# EAGLE design opamp (EAGLE 9.1.3)
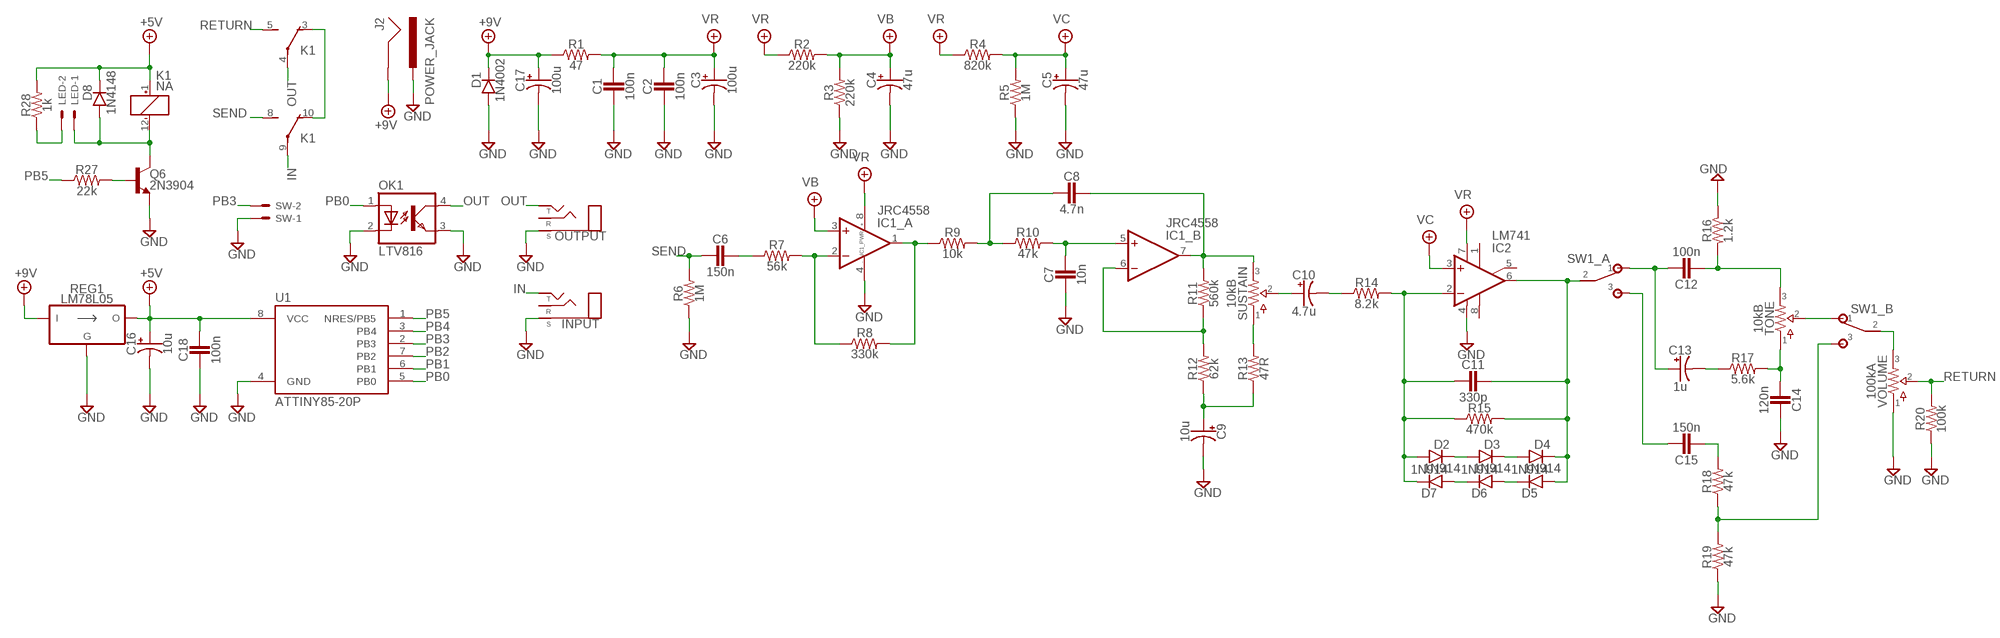
[diagram p0: schematic, sheet 1]

## Parts
C1  100n  CER/FILM2  [050X030_025_2]
C2  100n  CER/FILM2  [050X030_025_2]
C3  100u  0500  [050_020]
C4  47u  0500  [050_020]
C5  47u  0500  [050_020]
C6  150n  CER/FILMBOX.1  [BOX_SMALL]
C7  10n  CER/FILMBOX.1  [BOX_SMALL]
C8  4.7n  CER/FILMBOX.1  [BOX_SMALL]
C9  10u  0500  [050_020]
C10  4.7u  0500  [050_020]
C11  330p  CER/FILM2  [050X030_025_2]
C12  100n  CER/FILMBOX.1  [BOX_SMALL]
C13  1u  0400  [040_020]
C14  120n  CER/FILM2  [050X030_025_2]
C15  150n  CER/FILMBOX.1  [BOX_SMALL]
C16  10u  0500  [050_020]
C17  100u  0500  [050_020]
C18  100n  CER/FILM2  [050X030_025_2]
D1  1N4002  DO41.2  [DO41-2]
D2  1N914  DO35.2  [DO35-2]
D3  1N914  DO35.2  [DO35-2]
D4  1N914  DO35.2  [DO35-2]
D5  1N914  DO35.2  [DO35-2]
D6  1N914  DO35.2  [DO35-2]
D7  1N914  DO35.2  [DO35-2]
D8  1N4148  DO35.2  [DO35-2]
IC1  JRC4558  DUALTH  [DIL0]
IC2  LM741  SINGLETH  [DIL0]
INPUT  STEREONMJ  [NMJ6HCD2]
J2  POWER_JACK  [POWER_JACK_PTH]
K1  NA  [NA]
LED  JST-XH-02-PIN-ROUND-PAD  [JST-XH-02-PACKAGE-ROUND-PAD]
OK1  LTV816  [DIL04]
OUTPUT  STEREONMJ  [NMJ6HCD2]
Q6  2N3904  [TO92-]
R1  47  R_.3B  [R0207/3]
R2  220k  R_.3B  [R0207/3]
R3  220k  R_.3B  [R0207/3]
R4  820k  R_.3B  [R0207/3]
R5  1M  R_.3B  [R0207/3]
R6  1M  R_.3B  [R0207/3]
R7  56k  R_.3B  [R0207/3]
R8  330k  R_.3B  [R0207/3]
R9  10k  R_.3B  [R0207/3]
R10  47k  R_.3B  [R0207/3]
R11  560k  R_.3B  [R0207/3]
R12  62k  R_.3B  [R0207/3]
R13  47R  R_.3B  [R0207/3]
R14  8.2k  R_.3B  [R0207/3]
R15  470k  R_.3B  [R0207/3]
R16  1.2k  R_.3B  [R0207/3]
R17  5.6k  R_.3B  [R0207/3]
R18  47k  R_.3B  [R0207/3]
R19  47k  R_.3B  [R0207/3]
R20  100k  R_.3B  [R0207/3]
R27  22k  R_.3B  [R0207/3]
R28  1k  R_.3B  [R0207/3]
REG1  LM78L05  [TO92-]
SUSTAIN  10kB  POTS16MM  [16MM]
SW  JST-XH-02-PIN-ROUND-PAD  [JST-XH-02-PACKAGE-ROUND-PAD]
SW1  DPDT  [DPDT]
TONE  10kB  POTS16MM  [16MM]
U1  ATTINY85-20P  [PDIP08_300MIL]
VOLUME  100kA  POTS16MM  [16MM]

## Nets
+5V: C16.+ C18.1 D8.C K1.1(1:+) R28.2 REG1.3(VO) U1.8(VCC)
+18V: C17.+ D1.C J2.GND R1.1 REG1.1(VI) ; supply symbol labelled +9V
GND: C1.1 C2.1 C3.- C4.- C5.- C7.1 C9.- C14.1 C16.- C17.- C18.2 D1.A IC1.4(_PWR:V-) IC2.4(V-) INPUT.S J2.PWR OK1.2(C) OK1.3(EMIT) OUTPUT.S Q6.3(E) R3.1 R5.1 R6.1 R16.1 R19.1 R20.1 REG1.2(GND) SW.1 U1.4(GND) VOLUME.1
IN: INPUT.T K1.9(3:P)
N$1: D8.A K1.12(1:-) LED.1 Q6.1(C)
N$2: Q6.2(B) R27.2
N$3: C6.2 R7.1
N$4: IC1.2(_A:-IN) R7.2 R8.1
N$5: IC1.1(_A:OUT) R8.2 R9.1
N$6: C8.2 R9.2 R10.1
N$7: C7.2 IC1.5(_B:+IN) R10.2
N$8: C8.1 IC1.7(_B:OUT) R11.2 SUSTAIN.3
N$9: IC1.6(_B:-IN) R11.1 R12.2
N$10: C9.+ R12.1 R13.1
N$11: R13.2 SUSTAIN.1
N$12: C10.+ SUSTAIN.2
N$13: C10.- R14.1
N$14: C11.2 D2.A D7.C IC2.2(-IN) R14.2 R15.1
N$15: D2.C D3.A
N$16: D3.C D4.A
N$17: D6.C D7.A
N$18: D5.C D6.A
N$19: C11.1 D4.C D5.A IC2.6(OUT) R15.2 SW1.A2
N$20: C13.- R17.1
N$21: C14.2 R17.2 TONE.1
N$22: C12.2 R16.2 TONE.3
N$23: C15.2 R18.2
N$24: R18.1 R19.2 SW1.B3
N$25: SW1.B1 TONE.2
N$26: SW1.B2 VOLUME.3
N$27: LED.2 R28.1
N$28: C12.1 C13.+ SW1.A1
N$29: C15.1 SW1.A3
N$38: K1.3(2:O) K1.10(3:O)
OUT: K1.4(2:P) OK1.4(COL) OUTPUT.T
PB0: OK1.1(A) U1.5(PB0)
PB1: U1.6(PB1)
PB2: U1.7(PB2)
PB3: SW.2 U1.2(PB3)
PB4: U1.3(PB4)
PB5: R27.1 U1.1(NRES/PB5)
RETURN: K1.5(2:S) R20.2 VOLUME.2
SEND: C6.1 K1.8(3:S) R6.2
VB: C4.+ IC1.3(_A:+IN) R2.2 R3.2
VC: C5.+ IC2.3(+IN) R4.2 R5.2
VR: C1.2 C2.2 C3.+ IC1.8(_PWR:V+) IC2.7(V+) R1.2 R2.1 R4.1
Unconnected: IC2.1(ON1) IC2.5(ON2) IC2.8(OPT) INPUT.R OUTPUT.R

## Library data of the parts
C1 C2 C6-C8 C11 C12 C14 C15 C18 = pedals-capacitors-film:CER/FILM: 47 - 120pF Xicon Ceramic Disc 2.5mm lead spacing
C3-C5 C9 C10 C16 C17 = pedals-capacitors-elec:050
C13 = pedals-capacitors-elec:040
D1 = pedals-diodes:DO41: DO-41 Package Diodes: 1N4001 - 1N40019 Zener Diodes: 1N4728 - 1N4764
D2-D8 = pedals-diodes:DO35: DO-35 Package Diodes: 1N914
IC1 = pedals-integrated circuits:DUAL: OP AMP
IC2 = pedals-integrated circuits:SINGLE: OP AMP
INPUT OUTPUT = pedals-jacks:STEREO
J2 = pedals-jacks:POWER_JACK: Power Jack Connector This is the standard 5.5mm barrel jack for power. The PTH is the most common, proven, reliable, footprint. The Slot footprint only works if the mill layer is transmitted to the PCB fab house so be warned. Here are the connectors we sell at SparkFun: DC Barrel Power Jack/Connector <https://www.sparkfun.com/products/119> (PRT-00119) DC Barrel Power Jack/Connector (SMD) <https://www.sparkfun.com/products/12748> (PRT-12748) DC Barrel Jack Adapter - Breadboard Compatible <https://www.sparkfun.com/products/10811> (PRT-10811) It is used on this SparkFun product (and many, many others): SparkFun RedBoard - Programmed with Arduino <https://www.sparkfun.com/products/12757> (DEV-12757) Also, if you need a mating power supply or connector, please check these out: Wall Adapter Power Supply - 9VDC 650mA <https://www.sparkfun.com/products/298> (TOL-00298) DC Barrel Jack Adapter - Male <https://www.sparkfun.com/products/10287> (PRT-10287); PROD_ID: CONN-08197
K1 = pedals-relays:NA: RELAY; OC_FARNELL: unknown; OC_NEWARK: unknown
LED SW = pedals-headers:JST-XH-02-PIN: JST XH Connector 2 Pin Wire to board connector. Pitch: 2,54 mm, (0.100") Number of pins: 2 Created by Rembrandt Electronics www.rembrandtelectronics.com
OK1 = pedals-integrated circuits:LTV816: OPTO COUPLER Source: LITEON, LTV816.pdf; OC_FARNELL: unknown; OC_NEWARK: unknown
Q6 = pedals-transistors:2N3904: NPN Transistor
R1-R20 R27 R28 = pedals-resistors:R_
REG1 = pedals-regulators:LM78L05
SUSTAIN TONE VOLUME = pedals-potentiometers:POTS
SW1 = pedals-switches:DPDT
U1 = pedals-microcontrollers:ATTINY85*: ATMEL ATtiny 85 Packages: P = PDIP 08 30mil S = SOIC 08 EIAJ 208mil Technologies Note: for complete ordering code (temp. range, finish, tape&reel etc.) see www.atmel.com • Supply Voltage: V = (1.8…5.5)V | [blank] = (2.7…5.5)V • Speed: 10 = 10 MHz | 20 = 20 MHz Author: Dipl.-Ing. FH Rainer Bayer HHN Hochschule Heilbronn (Heilbronn University), rainer.bayer@hs-heilbronn.de Ingenieurbüro ing-rb, mail@ing-rb.de

## Board
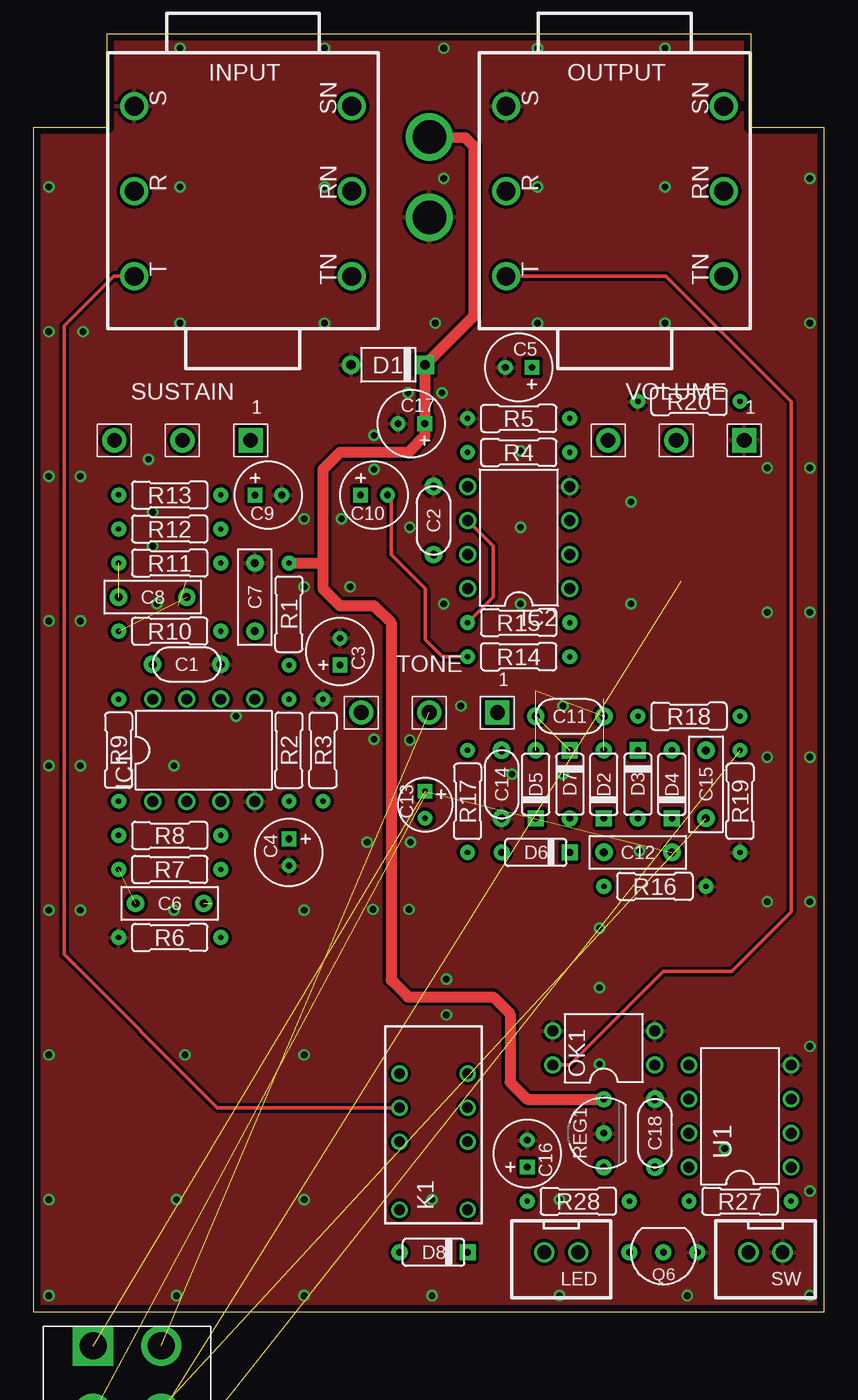
[diagram p1: board, top side]
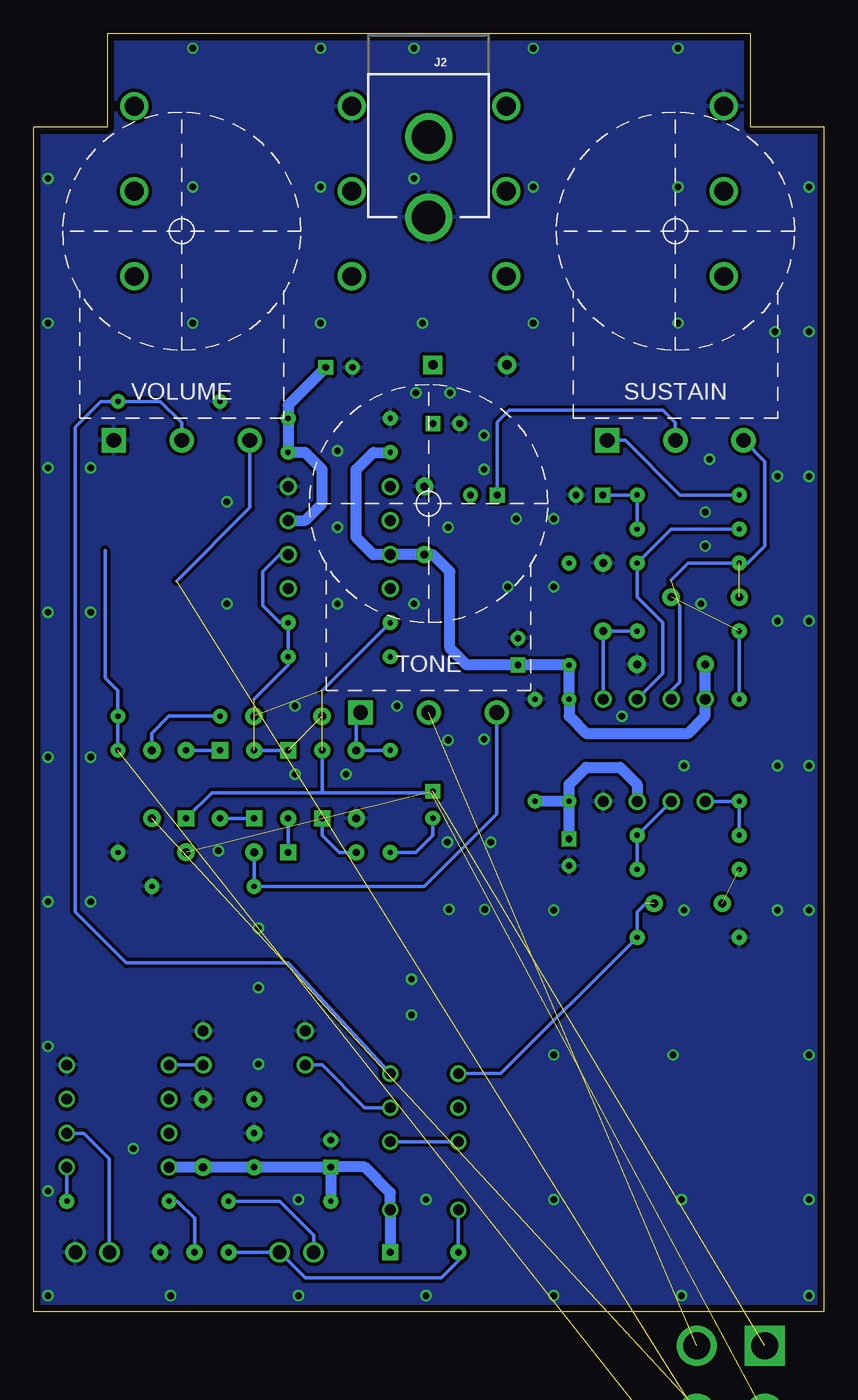
[diagram p2: board, bottom side, seen from below]

Size 59 x 95.4 mm. Coordinates in mm from the lower left corner, seen from the top.
Copper layers (1*16): Top 0.035mm / dielectric 1.6mm / Bottom 0.035mm
Design rules "Elecrow_2-layer_PCB_eagle_rule": minimum track width 6mil, minimum drill 12mil, track to track 6mil, track to pad 6mil, pad to pad 6mil, via to via 8mil, smd to smd 0mil, copper to edge 20mil, drill to drill 10mil, minimum pad ring 6mil, minimum via ring 6mil, stop-mask expansion 0mil, vias tented up to drill 100mil, thermal gap 10mil

### Footprints (pad centres in the part's own frame; a part is rotated, then mirrored left to right if it is on the bottom)
050X030_025_2 = drill 0.6 pad 1.3: 1 -2.54,0; 2 2.54,0
050_020 = drill 0.5 pad 1.1 square: + -0.998,0.001 | drill 0.5 pad 1.1: - 0.998,0.001
BOX_SMALL = drill 0.6 pad 1.3: 1 -2.54,0; 2 2.54,0
040_020 = drill 0.4 pad 1.1 square: + -1.001,0 | drill 0.4 pad 1.1: - 1.001,0
DO41-2 = drill 0.7 pad 1.4: A 2.794,0 | drill 0.7 pad 1.4 square: C -2.731,0
DO35-2 = drill 0.5 pad 1.2: A 2.54,0 | drill 0.5 pad 1.2 square: C -2.54,0
DIL0 = drill 0.813 pad 1.27: 1 -3.81,-3.81; 2 -1.27,-3.81; 3 1.27,-3.81; 4 3.81,-3.81; 5 3.81,3.81; 6 1.27,3.81; 7 -1.27,3.81; 8 -3.81,3.81
NMJ6HCD2 = drill 1.4: R 0,8.115; RN 0,-8.115; S 6.35,8.115; SN 6.35,-8.115; T -6.35,8.115; TN -6.35,-8.115
POWER_JACK_PTH = drill 2.5: GND 0,7.7; PWR 0,13.7
NA = drill 0.8: 1 -6.35,-2.54; 3 -1.27,-2.54; 4 1.27,-2.54; 5 3.81,-2.54; 8 3.81,2.54; 9 1.27,2.54; 10 -1.27,2.54; 12 -6.35,2.54
JST-XH-02-PACKAGE-ROUND-PAD = drill 1.016: 1 -1.27,0; 2 1.27,0
DIL04 = drill 0.813 pad 1.27: 1 -1.27,-3.81; 2 1.27,-3.81; 3 1.27,3.81; 4 -1.27,3.81
TO92- = drill 0.5 pad 1.2: 1 2.54,0; 2 0,0; 3 -2.54,0
R0207/3 = drill 0.4 pad 1.1: 1 -3.81,0; 2 3.81,0
TO92-' = drill 0.5 pad 1.194: 1 -2.54,0; 2 0,0; 3 2.54,0
16MM = drill 1.1 pad 1.8 square: 1 5.08,-1 | drill 1.1 pad 1.8: 2 0,-1; 3 -5.08,-1
DPDT = drill 2 pad 2.7 square: A1 -2.54,5.08 | drill 2 pad 2.7: A2 -2.54,0; A3 -2.54,-5.08; B1 2.54,5.08; B2 2.54,0; B3 2.54,-5.08
PDIP08_300MIL = drill 0.813: 1 -3.81,-3.81; 2 -1.27,-3.81; 3 1.27,-3.81; 4 3.81,-3.81; 5 3.81,3.81; 6 1.27,3.81; 7 -1.27,3.81; 8 -3.81,3.81

### Placement (x,y rotation side)
C1  11.43,48.32 180 top
C2  29.84,59.05 270 top
C3  22.86,49.28 90 top
C4  19.05,34.29 270 top
C5  36.19,70.48 180 top
C6  10.16,30.48 180 top
C7  16.51,53.34 270 top
C8  8.89,53.34 0 top
C9  17.53,60.96 0 top
C10  25.4,60.96 0 top
C11  40,44.45 180 top
C12  45.08,34.29 180 top
C13  29.21,37.85 270 top
C14  34.92,39.37 90 top
C15  50.16,39.37 90 top
C16  36.83,11.81 90 top
C17  28.19,66.29 180 top
C18  46.35,13.34 90 top
D1  26.48,70.68 180 top
D2  42.54,39.37 90 top
D3  45.08,39.37 270 top
D4  47.62,39.37 90 top
D5  37.46,39.37 90 top
D6  37.46,34.29 180 top
D7  40,39.37 270 top
D8  29.84,4.45 180 top
IC1  12.7,41.91 0 top
IC2  36.19,57.79 90 top
INPUT  15.62,83.63 90 top
J2  29.53,95.38 180 bottom
K1  29.84,13.97 90 top
LED  39.37,4.45 180 top
OK1  42.54,19.69 90 top
OUTPUT  43.37,83.63 90 top
Q6  46.99,4.45 180 top
R1  19.05,52.07 270 top
R2  19.05,41.91 270 top
R3  21.59,41.91 270 top
R4  36.19,64.14 0 top
R5  36.19,66.68 0 top
R6  10.16,27.94 0 top
R7  10.16,33.02 0 top
R8  10.16,35.56 180 top
R9  6.35,41.91 90 top
R10  10.16,50.8 0 top
R11  10.16,55.88 180 top
R12  10.16,58.42 180 top
R13  10.16,60.96 180 top
R14  36.19,48.9 0 top
R15  36.19,51.44 180 top
R16  46.35,31.75 180 top
R17  32.38,38.1 90 top
R18  48.89,44.45 180 top
R19  52.7,38.1 90 top
R20  48.89,67.94 0 top
R27  52.7,8.26 180 top
R28  40.64,8.26 180 top
REG1  LM78L05  [TO92-']  42.54,13.34 270 top
SUSTAIN  11.11,66.04 0 top
SW  54.61,4.45 180 top
SW1  6.98,-7.62 0 top
TONE  29.53,45.72 0 top
U1  52.7,14.61 90 top
U$1  [125B_PCB_HUGER]  0,7.62 0 top
VOLUME  47.94,66.04 0 top

### Tracks (layer width: path | path; a pad name or v marks a point on that pad's centre or on a via)
+5V
  Bottom 0.813: C16.+ 36.85,10.8 REG1.3 C18.1 U1.8 | C16.+ 34.31,10.81 32.38,8.89 K1.1 D8.C | C16.+ R28.2
+18V
  Top 0.813: J2.GND 32.21,87.61 32.83,87 32.83,74.3 D1.C 29.19,70.66 C17.+ 29.19,65.39 27.94,64.14 22.86,64.14 21.59,62.87 21.59,55.88 | 21.59,55.88 21.59,53.98 22.86,52.7 25.4,52.7 26.67,51.44 26.67,24.77 27.94,23.5 34.29,23.5 35.56,22.23 35.56,17.15 36.83,15.88 REG1.1 | R1.1 21.59,55.88
GND  (via drill 0.5 pad 0.85)
  other vias: 10.92,94.3 21.72,94.3 30.61,94.3 1.14,73.15 10.92,83.95 10.92,73.79 21.72,83.95 21.72,73.79 30.61,84.58 37.59,94.3 47.12,94.3 37.59,83.95 47.12,83.95 57.91,1.21 10.67,1.21 1.14,1.21 1.14,83.95 1.14,62.36 1.14,51.56 1.14,40.77 1.14,29.97 47.12,73.79 3.68,73.15 37.59,73.79 1.14,19.18 1.14,8.38 29.97,73.79 3.49,62.36 3.49,51.56 3.49,40.77 3.49,29.97 11.3,19.18 54.74,62.99 54.74,52.2 54.74,41.4 54.74,30.61 24.89,35.05 28.07,42.67 25.4,42.74 36.32,52.83 23.62,54.1 30.61,52.83 20.19,54.1 36.32,64.26 28.07,58.55 20.19,59.18 9.21,52.83 8.89,57.15 8.89,59.69 8.57,63.63 44.58,52.83 45.21,34.42 39.5,40.13 35.69,40.13 31.88,45.21 39.5,45.21 28.13,35.05 51.56,12.19 30.8,22.16 30.8,24.83 42.23,24.19 10.48,29.97 20.19,1.21 29.72,1.21 39.24,1.21 48.77,1.21 57.91,9.02 57.91,19.81 57.91,30.61 57.91,41.4 57.91,52.2 57.91,62.99 57.91,73.79 57.91,84.58 42.23,28.64 42.23,18.48 10.67,8.38 20.19,8.38 20.19,19.18 20.19,29.97 29.72,8.38 39.24,8.38 22.99,59.18 25.4,62.87 25.4,65.41 27.94,68.58 30.48,68.58 25.34,30.04 28,30.04 36.32,58.55 44.58,60.45 15.11,44.45 10.48,40.77
  pour Top (isolate 0.254): 0,88.27 0,-0.63 59.06,-0.63 59.06,88.9 53.34,88.27 53.34,95.25 5.71,95.25 5.71,88.27
  pour Bottom (isolate 0.254): 0,-0.63 59.06,-0.63 59.06,95.88 0,95.88
IN
  Top 0.254: INPUT.T 5.97,77.28 2.29,73.6 2.29,26.67 13.72,15.24 K1.9
N$1
  Bottom 0.254: K1.12 D8.A 27.3,3.81 28.57,2.54 38.73,2.54 LED.1 Q6.1
N$2
  Bottom 0.254: Q6.2 46.99,6.99 48.26,8.26 R27.2
N$3  (1 unrouted)
N$4
  Bottom 0.254: R7.2 R8.1 IC1.2
N$5
  Bottom 0.254: R8.2 R9.1 IC1.1
N$6  (1 unrouted)
  Bottom 0.254: R9.2 R10.1
N$7
  Bottom 0.254: IC1.5 C7.2 R10.2
N$8  (2 unrouted)
  Bottom 0.254: IC1.7 11.43,46.36 10.79,46.99 10.79,52.7 | 11.43,54.61 10.16,55.88 R11.2 5.71,55.88 4.44,57.15 4.44,63.45 SUSTAIN.3
N$9
  Bottom 0.254: IC1.6 12.06,47.62 12.06,51.44 13.97,53.34 R11.1 11.43,58.42 R12.2
N$10
  Bottom 0.254: R12.1 R13.1 C9.+
N$11
  Bottom 0.254: SUSTAIN.1 14.88,65.04 10.79,60.96 R13.2
N$12
  Bottom 0.254: SUSTAIN.2 11.11,66.36 12.06,67.31 23.49,67.31 24.4,66.4 C10.+
N$13
  Top 0.254: C10.- 26.67,60.69 26.67,56.52 29.21,53.98 29.21,50.17 30.48,48.9 R14.1
N$14  (2 unrouted)
  Bottom 0.254: D7.C D2.A | 42.54,45.72 40,48.26 R14.2 R15.1 40.64,51.44 41.91,52.7 41.91,55.25 40.64,56.52 IC2.2
N$15
  Bottom 0.254: D2.C D3.A
N$16
  Bottom 0.254: D3.C D4.A
N$17
  Bottom 0.254: D6.C D7.A
N$18
  Bottom 0.254: D6.A 36.19,34.29 37.46,35.56 D5.C
N$19  (3 unrouted)
  Top 0.254: R15.2 34.29,53.34 34.29,57.15 IC2.6
  Bottom 0.254: 29.32,38.73 37.46,38.73 | 37.46,38.73 45.72,38.73 D4.C | D5.A 37.46,38.73 | R15.2 37.46,46.36
N$20
  Bottom 0.254: C13.- 29.21,35.56 30.48,34.29 R17.1
N$21
  Bottom 0.254: R17.2 C14.2 34.92,44.4 TONE.1
N$22
  Bottom 0.254: TONE.3 24.45,37.15 29.84,31.75 R16.2 C12.2
N$23
  Bottom 0.254: C15.2 50.16,43.18 48.89,44.45 R18.2
N$24  (1 unrouted)
  Bottom 0.254: R19.2 R18.1 52.7,46.36 53.66,47.31 53.66,56.83
N$25  (1 unrouted)
N$26  (1 unrouted)
  Bottom 0.254: VOLUME.3 42.86,60.01 48.32,54.55
N$27
  Bottom 0.254: LED.2 38.1,5.72 40.64,8.26 R28.1
N$28  (2 unrouted)
N$29  (1 unrouted)
N$38
  Bottom 0.254: K1.10 K1.3
OUT
  Top 0.254: OUTPUT.T 47.18,77.28 56.51,67.94 56.51,29.85 52.07,25.4 46.99,25.4 40,18.42 OK1.4
  Bottom 0.254: K1.4 34.29,15.24 37.46,18.42 OK1.4
PB0
  Bottom 0.254: OK1.1 U1.5
PB3
  Bottom 0.254: SW.2 53.34,11.43 55.25,13.34 U1.2
PB5
  Bottom 0.254: U1.1 R27.1
RETURN
  Bottom 0.254: VOLUME.2 47.94,66.36 49.53,67.94 R20.2 53.97,67.94 55.88,66.04 55.88,29.85 52.07,26.04 40,26.04 K1.5
SEND  (1 unrouted)
  Bottom 0.254: K1.8 24.13,17.78 R6.2 13.97,29.85 13.33,30.48
VB
  Bottom 0.813: C4.+ R2.2 | R2.2 R3.2 | R2.2 19.05,39.37 17.78,40.64 15.24,40.64 13.97,39.37 IC1.3
VC
  Bottom 0.813: IC2.3 38.73,59.05 37.46,60.33 37.46,62.87 38.73,64.14 R4.2 R5.2 40,67.67 C5.+
VR
  Bottom 0.813: R4.1 33.65,64.14 34.92,62.87 34.92,57.79 33.65,56.52 IC2.7 C2.2 29.21,56.52 27.94,55.25 27.94,49.53 26.69,48.28 C3.+ 19.07,48.28 R1.2 R2.1 19.05,44.45 17.78,43.18 10.16,43.18 8.89,44.45 IC1.8 C1.2